# Altium schematic sheet MD029A_CSA.SchDoc
size Letter; Date: Not shown in title block; ApprovedBy: Not shown in title block; CheckedBy: Not shown in title block; Author: Not shown in title block; CompanyName: Not shown in title block; Engineer: Not shown in title block; Organization: Not shown in title block; Address1: Not shown in title block; Address2: Not shown in title block; Address3: Not shown in title block; Address4: Not shown in title block; DocumentNumber: 3; Revision: Use project parameter SCH_Rev; SheetNumber: 3; SheetTotal: 5; PageSetup: Record=PageOptions|CenterHorizontal=True|CenterVertical=True|PrintScale=1.00|XCorrection=1.00|YCorrection=1.00|PrintKind=0|BorderSize=5000000|LeftOffset=0|BottomOffset=0|Orientation=2|PaperLength=1000|PaperWidth=1000|Scale=100|PaperSource=15|PrintQuality=600|MediaType=1|DitherType=10|PaperKind=Letter|PrintScaleMode=1; CurrentTime: Not shown in title block; CurrentDate: Not shown in title block; Time: Not shown in title block; DocumentFullPathAndName: Not shown in title block; DocumentName: Not shown in title block; ModifiedDate: Not shown in title block; ImagePath: Not shown in title block
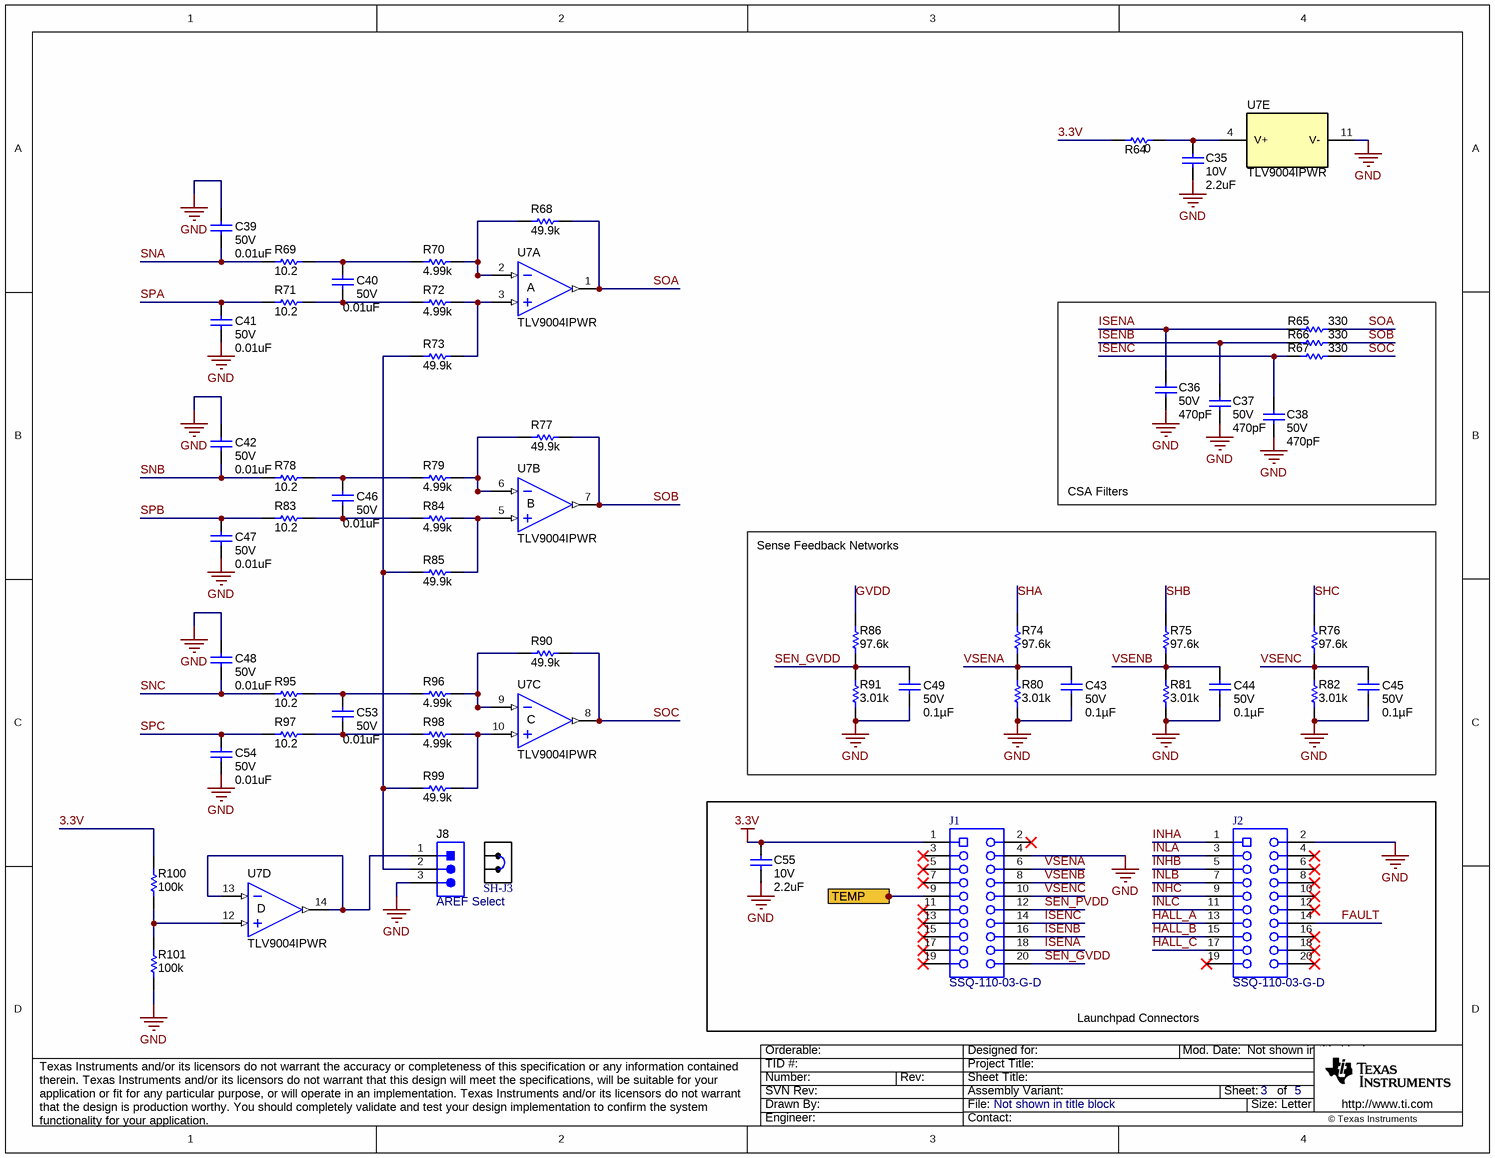
[diagram p0: MD029A_CSA.SchDoc]

## Parts
C35  VDC_V: 10V  ValueDisplayed: 2.2uF  [0402L]  (hidden comment: C1005X5R1A225K050BC)
C36  VDC_V: 50V  ValueDisplayed: 470pF  [0805L]  (hidden comment: C0805C471K5RACTU)
C37  VDC_V: 50V  ValueDisplayed: 470pF  [0805L]  (hidden comment: C0805C471K5RACTU)
C38  VDC_V: 50V  ValueDisplayed: 470pF  [0805L]  (hidden comment: C0805C471K5RACTU)
C39  VDC_V: 50V  ValueDisplayed: 0.01uF  [0603L]  (hidden comment: GCM188R71H103KA37D)
C40  VDC_V: 50V  ValueDisplayed: 0.01uF  [0603L]  (hidden comment: GCM188R71H103KA37D)
C41  VDC_V: 50V  ValueDisplayed: 0.01uF  [0603L]  (hidden comment: GCM188R71H103KA37D)
C42  VDC_V: 50V  ValueDisplayed: 0.01uF  [0603L]  (hidden comment: GCM188R71H103KA37D)
C43  Value2: 50V  ValueDisplayed: 0.1µF  [0603L]  (hidden comment: C0603C104K5RACAUTO)
C44  Value2: 50V  ValueDisplayed: 0.1µF  [0603L]  (hidden comment: C0603C104K5RACAUTO)
C45  Value2: 50V  ValueDisplayed: 0.1µF  [0603L]  (hidden comment: C0603C104K5RACAUTO)
C46  VDC_V: 50V  ValueDisplayed: 0.01uF  [0603L]  (hidden comment: GCM188R71H103KA37D)
C47  VDC_V: 50V  ValueDisplayed: 0.01uF  [0603L]  (hidden comment: GCM188R71H103KA37D)
C48  VDC_V: 50V  ValueDisplayed: 0.01uF  [0603L]  (hidden comment: GCM188R71H103KA37D)
C49  Value2: 50V  ValueDisplayed: 0.1µF  [0603L]  (hidden comment: C0603C104K5RACAUTO)
C53  VDC_V: 50V  ValueDisplayed: 0.01uF  [0603L]  (hidden comment: GCM188R71H103KA37D)
C54  VDC_V: 50V  ValueDisplayed: 0.01uF  [0603L]  (hidden comment: GCM188R71H103KA37D)
C55  VDC_V: 10V  ValueDisplayed: 2.2uF  [0402L]  (hidden comment: C1005X5R1A225K050BC)
J1  SSQ-110-03-G-D  [Samtec_SSQ-110-03-x-D]
J2  SSQ-110-03-G-D  [Samtec_SSQ-110-03-x-D]
J8  AREF Select  [WURTH_61300311121]
R64  value 0  [0603L]  (hidden comment: CRCW06030000Z0EA)
R65  ValueDisplayed: 330  [0805L]  (hidden comment: CRCW0805330RFKEAC)
R66  ValueDisplayed: 330  [0805L]  (hidden comment: CRCW0805330RFKEAC)
R67  ValueDisplayed: 330  [0805L]  (hidden comment: CRCW0805330RFKEAC)
R68  ValueDisplayed: 49.9k  [0603L]  (hidden comment: CRCW060349K9FKEA)
R69  ValueDisplayed: 10.2  [0603L]  (hidden comment: CRCW060310R2FKEA)
R70  ValueDisplayed: 4.99k  [0603L]  (hidden comment: CRCW06034K99FKEA)
R71  ValueDisplayed: 10.2  [0603L]  (hidden comment: CRCW060310R2FKEA)
R72  ValueDisplayed: 4.99k  [0603L]  (hidden comment: CRCW06034K99FKEA)
R73  ValueDisplayed: 49.9k  [0603L]  (hidden comment: CRCW060349K9FKEA)
R74  ValueDisplayed: 97.6k  [0603L]  (hidden comment: CRCW060397K6FKEA)
R75  ValueDisplayed: 97.6k  [0603L]  (hidden comment: CRCW060397K6FKEA)
R76  ValueDisplayed: 97.6k  [0603L]  (hidden comment: CRCW060397K6FKEA)
R77  ValueDisplayed: 49.9k  [0603L]  (hidden comment: CRCW060349K9FKEA)
R78  ValueDisplayed: 10.2  [0603L]  (hidden comment: CRCW060310R2FKEA)
R79  ValueDisplayed: 4.99k  [0603L]  (hidden comment: CRCW06034K99FKEA)
R80  ValueDisplayed: 3.01k  [0603L]  (hidden comment: CRCW06033K01FKEA)
R81  ValueDisplayed: 3.01k  [0603L]  (hidden comment: CRCW06033K01FKEA)
R82  ValueDisplayed: 3.01k  [0603L]  (hidden comment: CRCW06033K01FKEA)
R83  ValueDisplayed: 10.2  [0603L]  (hidden comment: CRCW060310R2FKEA)
R84  ValueDisplayed: 4.99k  [0603L]  (hidden comment: CRCW06034K99FKEA)
R85  ValueDisplayed: 49.9k  [0603L]  (hidden comment: CRCW060349K9FKEA)
R86  ValueDisplayed: 97.6k  [0603L]  (hidden comment: CRCW060397K6FKEA)
R90  ValueDisplayed: 49.9k  [0603L]  (hidden comment: CRCW060349K9FKEA)
R91  ValueDisplayed: 3.01k  [0603L]  (hidden comment: CRCW06033K01FKEA)
R95  ValueDisplayed: 10.2  [0603L]  (hidden comment: CRCW060310R2FKEA)
R96  ValueDisplayed: 4.99k  [0603L]  (hidden comment: CRCW06034K99FKEA)
R97  ValueDisplayed: 10.2  [0603L]  (hidden comment: CRCW060310R2FKEA)
R98  ValueDisplayed: 4.99k  [0603L]  (hidden comment: CRCW06034K99FKEA)
R99  ValueDisplayed: 49.9k  [0603L]  (hidden comment: CRCW060349K9FKEA)
R100  ValueDisplayed: 100k  [0603L]  (hidden comment: CRCW0603100KFKEA)
R101  ValueDisplayed: 100k  [0603L]  (hidden comment: CRCW0603100KFKEA)
SH-J3  SNT-100-BK-G  [SNT-100-BK-G]  (value not drawn)
U7  TLV9004IPWR  [PW0014A_N]  (parts A,B,C,D,E of 5)

## Blocks framed on the sheet
CSA Filters: C36-C38 R65-R67
Sense Feedback Networks: C43-C45 C49 R74-R76 R80-R82 R86 R91
Launchpad Connectors: C55 J1 J2

## Ports
TEMP (out)

## Nets
3.3V: C55.2 J1.1 R64.2 R100.2
GND: C35.1 C36.2 C37.2 C38.2 C39.1 C41.2 C42.1 C43.1 C44.1 C45.1 C47.2 C48.1 C49.1 C54.2 C55.1 J1.4 J2.2 J8.3 R80.1 R81.1 R82.1 R91.1 R101.1 U7.11(V-)
FAULT: J2.14
GVDD: R86.2
HALL_A: J2.13
HALL_B: J2.15
HALL_C: J2.17
INHA: J2.1
INHB: J2.5
INHC: J2.9
INLA: J2.3
INLB: J2.7
INLC: J2.11
ISENA: C36.1 J1.18 R65.1
ISENB: C37.1 J1.16 R66.1
ISENC: C38.1 J1.14 R67.1
SEN_GVDD: C49.2 J1.20 R86.1 R91.2
SEN_PVDD: J1.12
SHA: R74.2
SHB: R75.2
SHC: R76.2
SNA: C39.2 R69.1
SNB: C42.2 R78.1
SNC: C48.2 R95.1
SOA: R65.2 R68.2 U7.1(OUT)
SOB: R66.2 R77.2 U7.7(OUT)
SOC: R67.2 R90.2 U7.8(OUT)
SPA: C41.1 R71.1
SPB: C47.1 R83.1
SPC: C54.1 R97.1
TEMP: J1.9 ; port TEMP
VSENA: C43.2 J1.6 R74.1 R80.2
VSENB: C44.2 J1.8 R75.1 R81.2
VSENC: C45.2 J1.10 R76.1 R82.2
NetC35_2: C35.2 R64.1 U7.4(V+)
NetC40_1: C40.1 R69.2 R70.1
NetC40_2: C40.2 R71.2 R72.1
NetC46_1: C46.1 R78.2 R79.1
NetC46_2: C46.2 R83.2 R84.1
NetC53_1: C53.1 R95.2 R96.1
NetC53_2: C53.2 R97.2 R98.1
NetJ8_1: J8.1 U7.13(IN-) U7.14(OUT)
NetJ8_2: J8.2 R73.2 R85.2 R99.2
NetR68_1: R68.1 R70.2 U7.2(IN-)
NetR72_2: R72.2 R73.1 U7.3(IN+)
NetR77_1: R77.1 R79.2 U7.6(IN-)
NetR84_2: R84.2 R85.1 U7.5(IN+)
NetR90_1: R90.1 R96.2 U7.9(IN-)
NetR98_2: R98.2 R99.1 U7.10(IN+)
NetR100_1: R100.1 R101.2 U7.12(IN+)

Not connected (* = marked no-connect by the designer): J1 2* 3* 5* 7* 11* 13* 15* 17* 19*; J2 4* 6* 8* 10* 12* 16* 18* 19* 20*

## Notes on the sheet
- Drawn By:
- SVN Rev:
- Number:
- TID #:
- Orderable:
- Rev:
- Sheet Title:
- File:
- Project Title:
- Designed for:
- Assembly Variant:
- Mod. Date:
- Sheet:
- Size:
- of
- Letter
- http://www.ti.com
- Texas Instruments and/or its licensors do not warrant the accuracy or completeness of this specification or any information contained therein. Texas Instruments and/or its licensors do not warrant that this design will meet the specifications, will be suitable for your application or fit for any particular purpose, or will operate in an implementation. Texas Instruments and/or its licensors do not warrant that the design is production worthy. You should completely validate and test your design implementation to confirm the system functionality for your application.
- Engineer:
- Contact:
- © Texas Instruments
- (in symbol CMP-0860067-1, part A) A
- (in symbol CMP-0860067-1, part B) B
- (in symbol CMP-0860067-1, part C) C
- (in symbol CMP-0860067-1, part D) D

## Library data of the parts
C35 C55 = CMP-0006263-2: CAP, CERM, 2.2 uF, 10 V, +/- 10%, X5R, 0402; Manufacturer: TDK; TaMin_C: -55°C; Polarized: N; SizeAreaWB_mm2: 3; Value1: Unknown; U/M: EA; Value: 2.2uF; TaMax_C: 85°C; SizeZ_mm: 0.6; SizeX_mm: 1; SizeY_mm: 0.5; Cap_Case: 0402; Cap_F: 2.2µF; AEC Category: Q200; Supplier Part Number 2: 87R3267; Publisher: Texas Instruments; Supplier 2: Newark; TempCo: X5R; Published: 2008-06-19; RoHS: Y; MountType: SMT; Supplier 1: Digi-Key; PackageReference: 0402; Tolerance_%: 10%; Value2: 10V; SizeArea_mm2: 0.5; CompType: Capacitor; LatestRevisionDate: 2017-03-09; PartNumber: C1005X5R1A225K050BC; AEC Qualified: N; ComponentLink1Description: Datasheet link; AEC Grade: N/A; Supplier Part Number 1: 445-7392-1-ND; Technology: Ceramic; ComponentLink1URL: http://product.tdk.com/en/catalog/datasheets/mlcc_commercial_general_en.pdf
C36-C38 = CMP-0007796-2: CAP, CERM, 470 pF, 50 V, +/- 10%, X7R, 0805; Manufacturer: Kemet; TaMin_C: -55°C; ESR_ohm: 0.688; Polarized: N; SizeAreaWB_mm2: 6.75; Value1: 0.688 ohm; U/M: EA; Value: 470pF; TaMax_C: 125°C; SizeZ_mm: 1.45; SizeX_mm: 2; SizeY_mm: 1.25; Cap_Case: 0805; SizeArea_mm2: 2.5; IRMS_A: 213mA; AEC Category: Q200; Supplier Part Number 2: 80-C0805C471K5R; Publisher: Texas Instruments; Supplier 2: Mouser; TempCo: X7R; Published: 2008-06-19; RoHS: Y; MountType: SMT; Supplier 1: Digi-Key; PackageReference: 0805; Tolerance_%: 10%; Value2: 50V; CompType: Capacitor; LatestRevisionDate: 2017-03-09; PartNumber: C0805C471K5RACTU; AEC Qualified: ?; Cap_F: 470pF; ComponentLink1Description: Datasheet link; Supplier Part Number 1: 399-1142-1-ND; Technology: Ceramic; ComponentLink1URL: http://www.kemet.com/kemet/web/homepage/kechome.nsf/file/Partial%20Copy%20-%20Ceramic%20Surface%20Mount%20Capacitors/$file/F3102_CE.pdf
C39-C42 C46-C48 C53 C54 = CMP-0007143-4: CAP, CERM, 0.01 uF, 50 V, +/- 10%, X7R, AEC-Q200 Grade 1, 0603; Manufacturer: MuRata; TaMin_C: -55°C; Polarized: N; SizeAreaWB_mm2: 4.68; Value1: Unknown; U/M: EA; Value: 0.01uF; TaMax_C: 125°C; SizeZ_mm: 1; SizeX_mm: 1.6; SizeY_mm: 0.8; Cap_Case: 0603; SizeArea_mm2: 1.28; AEC Qualified: Y; Cap_F: 10nF; AEC Category: Q200; Supplier Part Number 2: 45Y5166; Publisher: Texas Instruments; Supplier 2: Newark; Supplier Part Number 3: 81-GCM188R71H103KA7D; TempCo: X7R; Supplier 3: Mouser; Published: 2008-06-19; RoHS: Y; MountType: SMT; Supplier 1: Digi-Key; PackageReference: 0603; Tolerance_%: 10%; Value2: 50V; CompType: Capacitor; LatestRevisionDate: 2017-03-09; PartNumber: GCM188R71H103KA37D; ComponentLink1Description: Datasheet link; AEC Grade: 1; Supplier Part Number 1: 490-4778-1-ND; Technology: Ceramic; ComponentLink1URL: http://psearch.en.murata.com/capacitor/product/GCM188R71H103KA37%23.pdf
C43-C45 C49 = CMP-0079602-1: CAP, CERM, 0.1 µF, 50 V,+/- 10%, X7R, AEC-Q200 Grade 1, 0603; Manufacturer: Kemet; TaMin_C: -55°C; Polarized: N; SizeAreaWB_mm2: 4.68; U/M: EA; Value: 0.1uF; TaMax_C: 125°C; SizeZ_mm: 1; SizeX_mm: 1.6; SizeY_mm: 0.8; Cap_Case: 0603; SizeArea_mm2: 1.28; AEC Qualified: Y; Cap_F: 100nF; AEC Category: Q200; ComponentLink1URL: https://search.kemet.com/component-edge/download/specsheet/C0603C104K5RACAUTO.pdf; Supplier Part Number 2: 96Y6965; Supplier 2: Newark; Supplier Part Number 3: 80-C0603C104K5RAUTO; TempCo: X7R; Supplier 3: Mouser; RoHS: Y; MountType: SMT; Supplier 1: Digi-Key; PackageReference: 0603; Tolerance_%: 10%; CompType: Capacitor; PartNumber: C0603C104K5RACAUTO; VDC_V: 50V; ComponentLink1Description: Datasheet link; AEC Grade: 1; Supplier Part Number 1: 399-6856-1-ND; Technology: Ceramic
J1 J2 = CMP-0075613-1: Receptacle, 2.54mm, 10x2, Gold, TH; Manufacturer: Samtec; Pitch_mm: 2.54; Cert_VDE: N; Gender: Female; Cert_CSA: Y; Current_A: 6.3A; Voltage_V: 550V; CT: True; Row_Count: 2; CompType: Socket Strip; CNHeader: False; ComponentLink1Description: Datasheet URL; RoHS: Y; Cert_UL: Y; Orientation: Vertical; PackageReference: Receptacle, 2.54mm, 10x2, TH; Color: Black; PartNumber: SSQ-110-03-G-D; PinCount: 20; Publisher: Texas Instruments; ContactFinish: Gold; Cert_CULUS: N; RowSpacing_mm: 2.54; ComponentLink1URL: https://www.samtec.com/ftppub/cpdf/SSQ-1XX-XX-XXX-X-XX-XXX-XX-X-MKT.pdf; LatestRevisionDate: 2017-07-12; MountType: TH
J8 = CMP-0054796-2: Header, 2.54 mm, 3x1, Gold, TH; Manufacturer: Wurth Elektronik; PartNumber: 61300311121; Green_Lifecycle: Active; Green_REACh: Passed; Cert_UL: Y; Gender: Male; Pitch_mm: 2.54; Row_Count: 1; Shrouded: N; ComponentLink1URL: http://katalog.we-online.de/em/datasheet/6130xx11121.pdf; ClassName: Header; Supplier Part Number 2: 20X0950; Supplier 2: Newark; Supplier Part Number 3: 356154; Supplier 3: Farnell; RoHS: Y; MountType: TH; Green_EU RoHS-2: Incomplete; Supplier 1: Digi-Key; Green_EU RoHS: Passed; PackageReference: Header, 2.54mm, 3x1, TH; CompType: Header; ComponentLink1Description: Datasheet URL; Supplier Part Number 1: 732-5316-ND; Color: Black; ContactFinish: Gold; Orientation: Vertical; PinCount: 3
R64 = CMP-0025697-4: RES, 0, 5%, 0.1 W, AEC-Q200 Grade 0, 0603; Manufacturer: Vishay-Dale; Value_Code: 0000; Power_W: 100mW; Value2: 0.1W; VDC_V: 75V; TempCo: 200 ppm/C; EIA_Code: E24; AEC Category: Q200; AEC Qualified: Y; SizeArea_mm2: 1.28; SizeX_mm: 1.6; SizeY_mm: 0.8; SizeZ_mm: 1; CompType: Resistor; PartNumber: CRCW06030000Z0EA; PackageReference: 0603; RoHS: E; Res_ohm: 0; Tolerance_%: 5%; Value1: 5%; MountType: SMT; Technology: Thick Film; ComponentLink1Description: Datasheet link; ComponentLink1URL: http://www.vishay.com/docs/20035/dcrcwe3.pdf; Supplier 1: Digi-Key; Supplier Part Number 1: 541-0.0GCT-ND; Supplier 2: Newark; Supplier Part Number 2: 52K8014; Supplier 3: Mouser; Supplier Part Number 3: 71-CRCW0603-0-E3; ValueDisplayed: 0; AEC Grade: 0
R65-R67 = CMP-0082535-1: RES, 330, 1%, 0.125 W, 0805; Manufacturer: Vishay-Dale; Power_W: 125mW; TempCo: 100 ppm/C; SizeAreaWB_mm2: 6.75; Value_Code: 330R; Value: 330; SizeX_mm: 2; SizeY_mm: 1.25; SizeZ_mm: 1.45; Value2: 0.125W; SizeArea_mm2: 2.5; AEC Qualified: N; VDC_V: 150V; AEC Category: Q200; ComponentLink1URL: http://www.vishay.com/docs/28773/crcwce3.pdf; Supplier Part Number 2: 71-CRCW0805330RFKEAC; Supplier 2: Mouser; RoHS: E; Value1: 1%; MountType: SMT; Supplier 1: Digi-Key; PackageReference: 0805; Tolerance_%: 1%; Res_ohm: 330; CompType: Resistor; PartNumber: CRCW0805330RFKEAC; ComponentLink1Description: Datasheet link; AEC Grade: N/A; Supplier Part Number 1: 541-4142-1-ND; Technology: Thick Film
R68 R73 R77 R85 R90 R99 = CMP-0022447-4: RES, 49.9 k, 1%, 0.1 W, AEC-Q200 Grade 0, 0603; Manufacturer: Vishay-Dale; Power_W: 100mW; TempCo: 100 ppm/C; Value_Code: 49k9; Value: 49.9k; EIA_Code: E96; SizeX_mm: 1.6; SizeY_mm: 0.8; SizeZ_mm: 1; Value2: 0.1W; SizeArea_mm2: 1.28; AEC Qualified: Y; VDC_V: 75V; AEC Category: Q200; AEC Grade: 0; Supplier Part Number 2: 71-CRCW0603-49.9K-E3; Supplier 2: Mouser; Supplier Part Number 3: 1652882; Supplier 3: Farnell; RoHS: E; Value1: 1%; MountType: SMT; Supplier 1: Digi-Key; PackageReference: 0603; Tolerance_%: 1%; Res_ohm: 49.9k; CompType: Resistor; PartNumber: CRCW060349K9FKEA; ComponentLink1Description: Datasheet link; Supplier Part Number 1: 541-49.9KHCT-ND; Technology: Thick Film; ComponentLink1URL: http://www.vishay.com/docs/20035/dcrcwe3.pdf
R69 R71 R78 R83 R95 R97 = CMP-0022005-4: RES, 10.2, 1%, 0.1 W, AEC-Q200 Grade 0, 0603; Manufacturer: Vishay-Dale; Power_W: 100mW; TempCo: 100 ppm/C; Value_Code: 10R2; Value: 10.2; EIA_Code: E96; SizeX_mm: 1.6; SizeY_mm: 0.8; SizeZ_mm: 1; Value2: 0.1W; SizeArea_mm2: 1.28; AEC Qualified: Y; VDC_V: 75V; AEC Category: Q200; AEC Grade: 0; Supplier Part Number 2: 71-CRCW0603-10.2-E3; Supplier 2: Mouser; Supplier Part Number 3: 1157185; Supplier 3: Farnell; RoHS: E; Value1: 1%; MountType: SMT; Supplier 1: Digi-Key; PackageReference: 0603; Tolerance_%: 1%; Res_ohm: 10.2; CompType: Resistor; PartNumber: CRCW060310R2FKEA; ComponentLink1Description: Datasheet link; Supplier Part Number 1: 541-10.2HCT-ND; Technology: Thick Film; ComponentLink1URL: http://www.vishay.com/docs/20035/dcrcwe3.pdf
R70 R72 R79 R84 R96 R98 = CMP-0022458-4: RES, 4.99 k, 1%, 0.1 W, AEC-Q200 Grade 0, 0603; Manufacturer: Vishay-Dale; Power_W: 100mW; TempCo: 100 ppm/C; Value_Code: 4k99; Value: 4.99k; EIA_Code: E96; SizeX_mm: 1.6; SizeY_mm: 0.8; SizeZ_mm: 1; Value2: 0.1W; SizeArea_mm2: 1.28; AEC Qualified: Y; VDC_V: 75V; AEC Category: Q200; AEC Grade: 0; Supplier Part Number 2: 52K8500; Supplier 2: Newark; Supplier Part Number 3: 71-CRCW0603-4.99K-E3; Supplier 3: Mouser; RoHS: E; Value1: 1%; MountType: SMT; Supplier 1: Digi-Key; PackageReference: 0603; Tolerance_%: 1%; Res_ohm: 4.99k; CompType: Resistor; PartNumber: CRCW06034K99FKEA; ComponentLink1Description: Datasheet link; Supplier Part Number 1: 541-4.99KHCT-ND; Technology: Thick Film; ComponentLink1URL: http://www.vishay.com/docs/20035/dcrcwe3.pdf
R74-R76 R86 = CMP-0022663-4: RES, 97.6 k, 1%, 0.1 W, AEC-Q200 Grade 0, 0603; Manufacturer: Vishay-Dale; Power_W: 100mW; TempCo: 100 ppm/C; Value_Code: 97k6; Value: 97.6k; EIA_Code: E96; SizeX_mm: 1.6; SizeY_mm: 0.8; SizeZ_mm: 1; Value2: 0.1W; SizeArea_mm2: 1.28; AEC Qualified: Y; VDC_V: 75V; AEC Category: Q200; AEC Grade: 0; Supplier Part Number 2: 52K8787; Supplier 2: Newark; Supplier Part Number 3: 71-CRCW0603-97.6K-E3; Supplier 3: Mouser; RoHS: E; Value1: 1%; MountType: SMT; Supplier 1: Digi-Key; PackageReference: 0603; Tolerance_%: 1%; Res_ohm: 97.6k; CompType: Resistor; PartNumber: CRCW060397K6FKEA; ComponentLink1Description: Datasheet link; Supplier Part Number 1: 541-97.6KHCT-ND; Technology: Thick Film; ComponentLink1URL: http://www.vishay.com/docs/20035/dcrcwe3.pdf
R80-R82 R91 = CMP-0022371-4: RES, 3.01 k, 1%, 0.1 W, AEC-Q200 Grade 0, 0603; Manufacturer: Vishay-Dale; Power_W: 100mW; TempCo: 100 ppm/C; Value_Code: 3k01; Value: 3.01k; EIA_Code: E96; SizeX_mm: 1.6; SizeY_mm: 0.8; SizeZ_mm: 1; Value2: 0.1W; SizeArea_mm2: 1.28; AEC Qualified: Y; VDC_V: 75V; AEC Category: Q200; AEC Grade: 0; Supplier Part Number 2: 52K8370; Supplier 2: Newark; Supplier Part Number 3: 71-CRCW0603-3.01K-E3; Supplier 3: Mouser; RoHS: E; Value1: 1%; MountType: SMT; Supplier 1: Digi-Key; PackageReference: 0603; Tolerance_%: 1%; Res_ohm: 3.01k; CompType: Resistor; PartNumber: CRCW06033K01FKEA; ComponentLink1Description: Datasheet link; Supplier Part Number 1: 541-3.01KHCT-ND; Technology: Thick Film; ComponentLink1URL: http://www.vishay.com/docs/20035/dcrcwe3.pdf
R100 R101 = CMP-0021990-4: RES, 100 k, 1%, 0.1 W, AEC-Q200 Grade 0, 0603; Manufacturer: Vishay-Dale; Power_W: 100mW; TempCo: 100 ppm/C; Value: 100k; EIA_Code: E96; SizeX_mm: 1.6; SizeY_mm: 0.8; SizeZ_mm: 1; Value2: 0.1W; SizeArea_mm2: 1.28; AEC Qualified: Y; VDC_V: 75V; AEC Category: Q200; AEC Grade: 0; Supplier Part Number 2: 42K3668; Supplier 2: Newark; Supplier Part Number 3: 71-CRCW0603-100K-E3; Supplier 3: Mouser; Value_Code: 100k; RoHS: E; Value1: 1%; MountType: SMT; Supplier 1: Digi-Key; PackageReference: 0603; Tolerance_%: 1%; Res_ohm: 100k; CompType: Resistor; PartNumber: CRCW0603100KFKEA; ComponentLink1Description: Datasheet link; Supplier Part Number 1: 541-100KHCT-ND; Technology: Thick Film; ComponentLink1URL: http://www.vishay.com/docs/20035/dcrcwe3.pdf
SH-J3 = CMP-0003623-3: Shunt, 100mil, Gold plated, Black; Alternate PartNumber: 969102-0000-DA; Manufacturer: Samtec; Alternate Manufacturer: 3M; Value: 1x2; ComponentLink1URL: http://www.samtec.com/ftppub/pdf/SNT.PDF; Supplier 1: Digi-Key; CompType: Shunt; PackageReference: Shunt; ClassName: Shunt; RoHS: Y; Supplier Part Number 1: SAM8858-ND; MountType: N/A; PartNumber: SNT-100-BK-G; ComponentLink1Description: Datasheet Link
U7 = CMP-0860067-1: 4-Channel, 1MHz, RRIO, 1.8V to 5.5V Operational Amplifier for Cost-Optimized Systems, PW0014A (TSSOP-14); Alternate Manufacturer: Texas Instruments; Rating: Catalog; SizeY_mm: 5; CompType: IC; SizeAreaWB_mm2: 58.8; AEC Qualified: N; SizeArea_mm2: 32; SizeZ_mm: 1.2; SizeX_mm: 6.4; AEC Category: Q200; ComponentLink2URL: http://www.ti.com/product/tlv9004; ComponentLink1URL: http://www.ti.com/lit/ds/symlink/tlv9004.pdf; PackageDescription: TSSOP-14; ComponentLink3Description: Online Datasheet; ComponentLink2Description: Product Folder; ComponentLink1Description: Datasheet Link; Manufacturer: Texas Instruments; PartNumber: TLV9004IPWR; PackageReference: PW0014A; RoHS: Y; MountType: SMT; Operating Temperature Range: -40 to 125 C; ComponentLink3URL: http://www.ti.com/product/tlv9004/datasheet; PartId: 1